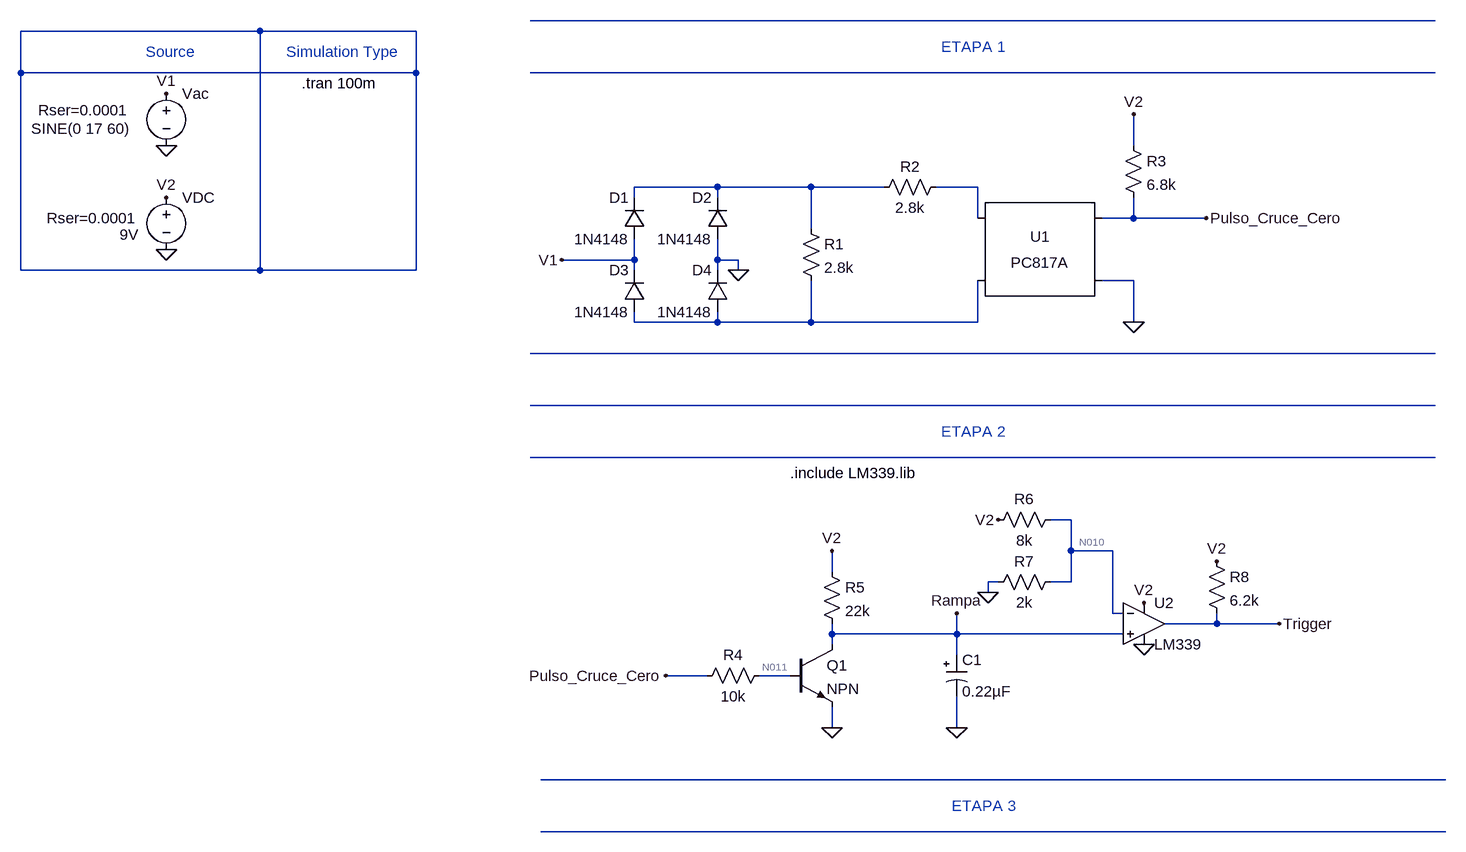
[diagram p0: schematic Simulacion.asc]
Simulacion.asc, the LTspice schematic file:
Version 4
SHEET 1 996 952
WIRE 976 -544 -416 -544
WIRE -832 -528 -1200 -528
WIRE -592 -528 -832 -528
WIRE -1200 -464 -1200 -528
WIRE -592 -464 -592 -528
WIRE -592 -464 -1200 -464
WIRE 976 -464 -416 -464
WIRE 512 -352 512 -400
WIRE -128 -288 -256 -288
WIRE 16 -288 -128 -288
WIRE 128 -288 16 -288
WIRE 272 -288 208 -288
WIRE -256 -272 -256 -288
WIRE -128 -272 -128 -288
WIRE 272 -240 272 -288
WIRE 512 -240 512 -272
WIRE 512 -240 464 -240
WIRE 624 -240 512 -240
WIRE 16 -224 16 -288
WIRE -256 -176 -256 -208
WIRE -256 -176 -368 -176
WIRE -128 -176 -128 -208
WIRE -96 -176 -128 -176
WIRE -1200 -160 -1200 -464
WIRE -832 -160 -832 -528
WIRE -832 -160 -1200 -160
WIRE -592 -160 -592 -464
WIRE -592 -160 -832 -160
WIRE -256 -160 -256 -176
WIRE -128 -160 -128 -176
WIRE -96 -160 -96 -176
WIRE 512 -144 464 -144
WIRE -256 -80 -256 -96
WIRE -128 -80 -128 -96
WIRE -128 -80 -256 -80
WIRE 16 -80 16 -144
WIRE 16 -80 -128 -80
WIRE 272 -80 272 -144
WIRE 272 -80 16 -80
WIRE 512 -80 512 -144
WIRE 976 -32 -416 -32
WIRE 976 48 -416 48
WIRE 976 128 -416 128
WIRE 416 224 384 224
WIRE 416 272 416 224
WIRE 480 272 416 272
WIRE 48 304 48 272
WIRE 304 320 288 320
WIRE 416 320 416 272
WIRE 416 320 384 320
WIRE 288 336 288 320
WIRE 480 368 480 272
WIRE 496 368 480 368
WIRE 640 384 640 368
WIRE 640 384 560 384
WIRE 736 384 640 384
WIRE 48 400 48 384
WIRE 240 400 240 368
WIRE 240 400 48 400
WIRE 496 400 240 400
WIRE 48 416 48 400
WIRE 240 432 240 400
WIRE -144 464 -208 464
WIRE -16 464 -64 464
WIRE 48 544 48 512
WIRE 240 544 240 496
WIRE 992 624 -400 624
WIRE 992 704 -400 704
FLAG -976 -352 0
FLAG -976 -192 0
FLAG -976 -432 V1
FLAG -976 -272 V2
FLAG -368 -176 V1
FLAG -96 -160 0
FLAG 512 -400 V2
FLAG 512 -80 0
FLAG 624 -240 Pulso_Cruce_Cero
FLAG -208 464 Pulso_Cruce_Cero
FLAG 48 272 V2
FLAG 48 544 0
FLAG 240 544 0
FLAG 304 224 V2
FLAG 288 336 0
FLAG 528 352 V2
FLAG 528 416 0
FLAG 736 384 Trigger
FLAG 640 288 V2
FLAG 240 368 Rampa
SYMBOL voltage -976 -448 R0
WINDOW 3 -208 70 Left 2
WINDOW 123 0 0 Left 0
WINDOW 39 -197 42 Left 2
SYMATTR Value SINE(0 17 60)
SYMATTR SpiceLine Rser=0.0001
SYMATTR InstName Vac
SYMBOL voltage -976 -288 R0
WINDOW 3 -72 73 Left 2
WINDOW 123 0 0 Left 0
WINDOW 39 -184 48 Left 2
SYMATTR Value 9V
SYMATTR SpiceLine Rser=0.0001
SYMATTR InstName VDC
SYMBOL diode -240 -208 R180
WINDOW 0 24 64 Left 2
WINDOW 3 24 0 Left 2
SYMATTR InstName D1
SYMATTR Value 1N4148
SYMBOL diode -112 -208 R180
WINDOW 0 24 64 Left 2
WINDOW 3 24 0 Left 2
SYMATTR InstName D2
SYMATTR Value 1N4148
SYMBOL diode -240 -96 R180
WINDOW 0 24 64 Left 2
WINDOW 3 24 0 Left 2
SYMATTR InstName D3
SYMATTR Value 1N4148
SYMBOL diode -112 -96 R180
WINDOW 0 24 64 Left 2
WINDOW 3 24 0 Left 2
SYMATTR InstName D4
SYMATTR Value 1N4148
SYMBOL res 0 -240 R0
SYMATTR InstName R1
SYMATTR Value 2.8k
SYMBOL res 224 -304 R90
WINDOW 0 0 56 VBottom 2
WINDOW 3 32 56 VTop 2
SYMATTR InstName R2
SYMATTR Value 2.8k
SYMBOL Optos\\PC817A 368 -192 R0
SYMATTR InstName U1
SYMBOL res 496 -368 R0
SYMATTR InstName R3
SYMATTR Value 6.8k
SYMBOL res -48 448 R90
WINDOW 0 0 56 VBottom 2
WINDOW 3 32 56 VTop 2
SYMATTR InstName R4
SYMATTR Value 10k
SYMBOL npn -16 416 R0
SYMATTR InstName Q1
SYMBOL res 32 288 R0
SYMATTR InstName R5
SYMATTR Value 22k
SYMBOL polcap 224 432 R0
SYMATTR InstName C1
SYMATTR Value 0.22µF
SYMBOL OpAmps\\opamp2 528 320 R0
SYMATTR InstName U2
SYMATTR Value LM339
SYMBOL res 400 208 R90
WINDOW 0 0 56 VBottom 2
WINDOW 3 32 56 VTop 2
SYMATTR InstName R6
SYMATTR Value 8k
SYMBOL res 288 336 R270
WINDOW 0 32 56 VTop 2
WINDOW 3 0 56 VBottom 2
SYMATTR InstName R7
SYMATTR Value 2k
SYMBOL res 624 272 R0
SYMATTR InstName R8
SYMATTR Value 6.2k
TEXT -1008 -496 Left 2 ;Source
TEXT -768 -448 Left 2 !.tran 100m
TEXT -792 -496 Left 2 ;Simulation Type
TEXT 216 -504 Left 2 ;ETAPA 1
TEXT 216 88 Left 2 ;ETAPA 2
TEXT -16 152 Left 2 !.include LM339.lib
TEXT 232 664 Left 2 ;ETAPA 3

The netlist it stands for:
* Simulacion.asc
Vac V1 0 SINE(0 17 60) Rser=0.0001
VDC V2 0 9V Rser=0.0001
D1 V1 N004 1N4148
D2 0 N004 1N4148
D3 N006 V1 1N4148
D4 N006 0 1N4148
R1 N004 N006 2.8k
R2 N005 N004 2.8k
XU1 N005 N006 Pulso_Cruce_Cero 0 PC817 Igain=1m
R3 V2 Pulso_Cruce_Cero 6.8k
R4 N011 Pulso_Cruce_Cero 10k
Q1 Rampa N011 0 0 NPN
R5 V2 Rampa 22k
C1 Rampa 0 0.22µF
XU2 Rampa N010 V2 0 Trigger LM339  ; pins In+ In- V+ V- OUT
R6 N010 V2 8k
R7 0 N010 2k
R8 V2 Trigger 6.2k
.model D D
.lib standard.dio
.model NPN NPN
.model PNP PNP
.lib standard.bjt
* Source
.tran 100m
* Simulation Type
* ETAPA 1
* ETAPA 2
.include LM339.lib
* ETAPA 3
.lib PC817.sub
.backanno
.end

* Results of the author's LTspice run, read from the files saved beside the schematic
* Operating Point, zero values left out:
*   V(v2) = 9 V
*   V(pulso_cruce_cero) = 5.674 V
*   V(n011) = 782.2 mV
*   V(rampa) = 27.16 mV
*   V(n010) = 1.8 V
*   V(trigger) = 72.38 mV
*   Ic(Q1) = 407.9 µA
*   Ib(Q1) = 489.2 µA
*   Ie(Q1) = -897.1 µA
*   I(R8) = 1.44 mA
*   I(R7) = -900 µA
*   I(R6) = -900 µA
*   I(R5) = 407.9 µA
*   I(R4) = -489.2 µA
*   I(R3) = 489.2 µA
*   I(Vdc) = -3.431 mA
*   Ix(u1:3) = 18.33 pA
*   Ix(u1:4) = -18.32 pA
*   Ix(u2:1) = -49.98 nA
*   Ix(u2:2) = 3.455 pA
*   Ix(u2:3) = 194.4 µA
*   Ix(u2:4) = -1.634 mA
*   Ix(u2:5) = 1.44 mA
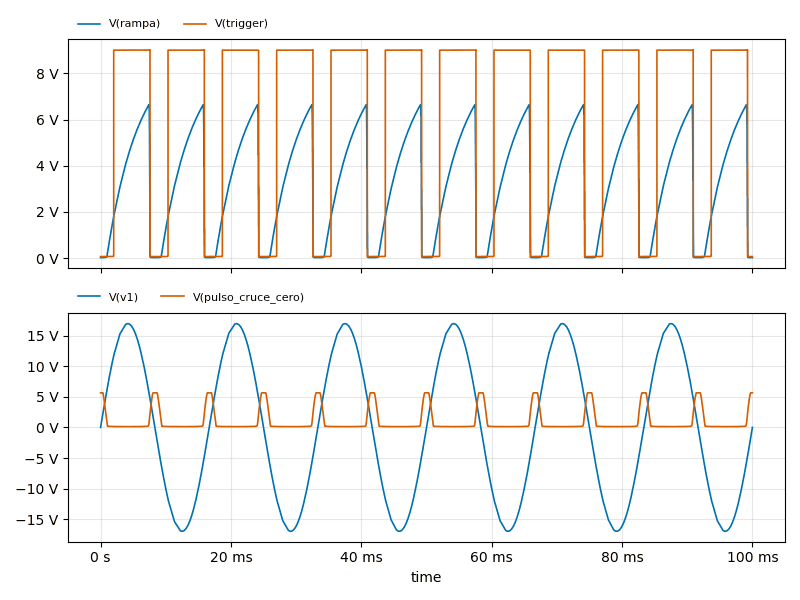
[diagram p1: Transient Analysis of Simulacion.asc, plotted from the saved traces]
* Transient Analysis, 1 run:
*   V(rampa): min 27.16 mV, max 6.645 V, average 3.249 V, rms 4.008 V, last 27.16 mV
*   V(trigger): min 72.29 mV, max 9.014 V, average 6.032 V, rms 7.354 V, last 72.38 mV
*   V(v1): min -17 V, max 17 V, average -1.9 mV, rms 11.99 V, last 0 V
*   V(pulso_cruce_cero): min 135 mV, max 5.674 V, average 1.081 V, rms 2.155 V, last 5.673 V